# EAGLE design LED Sectional (EAGLE 9.1.3)
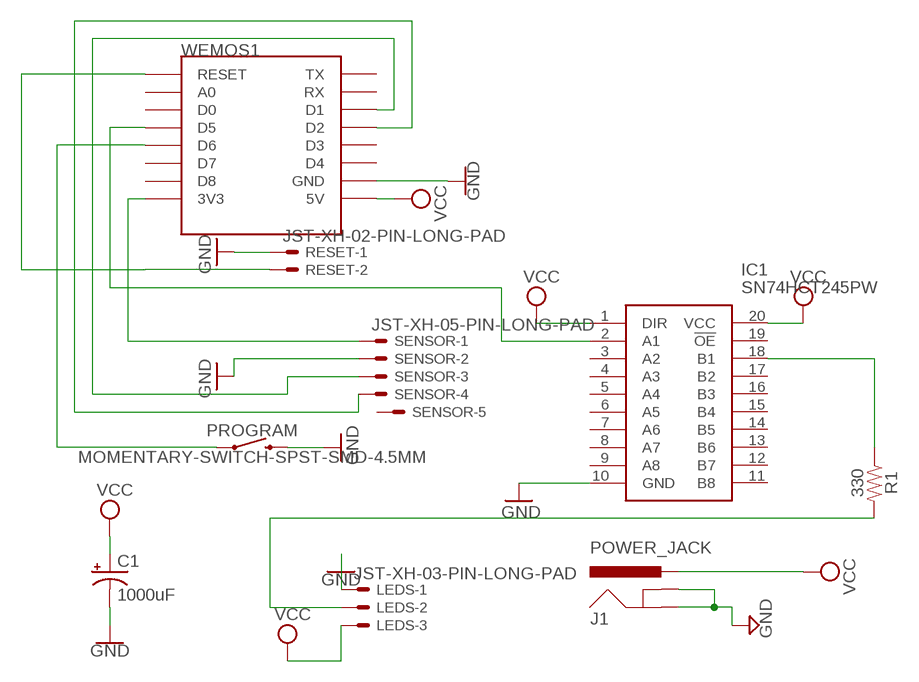
[diagram p0: schematic, sheet 1]

## Parts
C1  1000uF  CPOL-USCT7343  [CT7343]
IC1  SN74HCT245PW  [SOP65P640X120-20N]
J1  POWER_JACK  [POWER_JACK_PTH]
LEDS  JST-XH-03-PIN-LONG-PAD  [JST-XH-03-PACKAGE-LONG-PAD]
PROGRAM  MOMENTARY-SWITCH-SPST-SMD-4.5MM  [TACTILE_SWITCH_SMD_4.5MM]
R1  330  330OHM-0603-1/10W-1%  [0603]
RESET  JST-XH-02-PIN-LONG-PAD  [JST-XH-02-PACKAGE-LONG-PAD]
SENSOR  JST-XH-05-PIN-LONG-PAD  [JST-XH-05-PACKAGE-LONG-PAD]
WEMOS1  WEMOS-D1-MINI  [WEMOS-D1-MINI]

## Nets
GND: C1.- IC1.10(GND) J1.GND J1.GNDBREAK LEDS.1 PROGRAM.1 PROGRAM.4 RESET.1 SENSOR.2 WEMOS1.GND
N$1: SENSOR.1 WEMOS1.3V3
N$2: LEDS.2 R1.2
N$3: IC1.2(A1) WEMOS1.D5
N$4: IC1.18(B1) R1.1
N$5: SENSOR.3 WEMOS1.D1
N$6: SENSOR.4 WEMOS1.D2
N$7: PROGRAM.2 PROGRAM.3 WEMOS1.D6
N$8: RESET.2 WEMOS1.RESET
VCC: C1.+ IC1.1(DIR) IC1.20(VCC) J1.PWR LEDS.3 WEMOS1.5V
Unconnected: IC1.3(A2) IC1.4(A3) IC1.5(A4) IC1.6(A5) IC1.7(A6) IC1.8(A7) IC1.9(A8) IC1.11(B8) IC1.12(B7) IC1.13(B6) IC1.14(B5) IC1.15(B4) IC1.16(B3) IC1.17(B2) IC1.19(!OE) SENSOR.5 WEMOS1.A0 WEMOS1.D0 WEMOS1.D3 WEMOS1.D4 WEMOS1.D7 WEMOS1.D8 WEMOS1.RX WEMOS1.TX

## Library data of the parts
C1 = adafruit:CPOL-US: POLARIZED CAPACITOR, American symbol
IC1 = SN74HCT245PW:SN74HCT245PW: Texas Instruments SN74HCT245PW, Bus Transceiver, 8-Bit Non-Inverting CMOS, 5V, 20-Pin TSSOP Source: Datasheet <http://www.ti.com/lit/gpn/sn74hct245>; DESCRIPTION: Texas Instruments SN74HCT245PW, Bus Transceiver, 8-Bit Non-Inverting CMOS, 5V, 20-Pin TSSOP; HEIGHT: 1.2mm; MANUFACTURER_NAME: Texas Instruments; MANUFACTURER_PART_NUMBER: SN74HCT245PW; MOUSER_PART_NUMBER: 595-SN74HCT245PW; MOUSER_PRICE-STOCK: https://www.mouser.com/Search/Refine.aspx?Keyword=595-SN74HCT245PW; RS_PART_NUMBER: 6632287; RS_PRICE-STOCK: https://uk.rs-online.com/web/p/products/6632287
J1 = SparkFun-Connectors:POWER_JACK: Power Jack Connector This is the standard 5.5mm barrel jack for power. The PTH is the most common, proven, reliable, footprint. The Slot footprint only works if the mill layer is transmitted to the PCB fab house so be warned. Here are the connectors we sell at SparkFun: DC Barrel Power Jack/Connector <https://www.sparkfun.com/products/119> (PRT-00119) DC Barrel Power Jack/Connector (SMD) <https://www.sparkfun.com/products/12748> (PRT-12748) DC Barrel Jack Adapter - Breadboard Compatible <https://www.sparkfun.com/products/10811> (PRT-10811) It is used on this SparkFun product (and many, many others): SparkFun RedBoard - Programmed with Arduino <https://www.sparkfun.com/products/12757> (DEV-12757) Also, if you need a mating power supply or connector, please check these out: Wall Adapter Power Supply - 9VDC 650mA <https://www.sparkfun.com/products/298> (TOL-00298) DC Barrel Jack Adapter - Male <https://www.sparkfun.com/products/10287> (PRT-10287); PROD_ID: CONN-08197
LEDS = Rembrandt Electronics - JST XH Connectors v1-0:JST-XH-03-PIN: JST XH Connector 2 Pin Wire to board connector. Pitch: 2,54 mm, (0.100") Number of pins: 3 Created by Rembrandt Electronics www.rembrandtelectronics.com
PROGRAM = SparkFun-Switches:MOMENTARY-SWITCH-SPST: Momentary Switch (Pushbutton) - SPST Normally-open (NO) SPST momentary switches (buttons, pushbuttons). Variants PTH-12MM - 12mm square, through-hole Momentary Pushbutton Switch - 12mm Square <https://www.sparkfun.com/products/9190> (COM-09190) PTH-6.0MM, PTH-6.0MM-KIT - 6.0mm square, through-hole Mini Pushbutton Switch <https://www.sparkfun.com/products/97> (COM-00097) KIT package intended for soldering kit's - only one side of pads' copper is exposed. PTH-RIGHT-ANGLE-KIT - Right-angle, through-hole Right Angle Tactile Button <https://www.sparkfun.com/products/10791> - Used on SparkFun BigTime Watch Kit <https://www.sparkfun.com/products/11734> SMD-12MM - 12mm square, surface-mount Tactile Button - SMD (12mm) <https://www.sparkfun.com/products/12993> (COM-12993) Used on SparkFun PicoBoard <https://www.sparkfun.com/products/11888> SMD-4.5MM - 4.5mm Square Trackball Switch Used on SparkFun Blackberry Trackballer Breakout <https://www.sparkfun.com/products/13169> SMD-4.6MMX2.8MM - 4.60mm x 2.80mm, surface mount Used on SparkFun SAMD21 Mini Breakout <https://www.sparkfun.com/products/13664> SMD-5.2MM, SMD-5.2-REDUNDANT - 5.2mm square, surface-mount Mini Pushbutton Switch - SMD <https://www.sparkfun.com/products/8720> (COM-08720) Used on Arduino Pro Mini <https://www.sparkfun.com/products/11114> REDUNDANT package connects both switch circuits together SMD-6.0X3.5MM - 6.0 x 3.5mm, surface mount Momentary Reset Switch SMD <https://www.sparkfun.com/products/8229> (COM-08229) SMD-6.2MM-TALL - 6.2mm square, surface mount Tactile Button - SMD (6mm) <https://www.sparkfun.com/products/12992> Used on SparkFun Digital Sandbox <https://www.sparkfun.com/products/12651> SMD-RIGHT-ANGLE - Right-angle, surface mount Used on SparkFun Block for Intel® Edison - Arduino <https://www.sparkfun.com/products/13036>; PROD_ID: SWCH-09213
R1 = SparkFun-Resistors:330OHM: 330Ω resistor A resistor is a passive two-terminal electrical component that implements electrical resistance as a circuit element. Resistors act to reduce current flow, and, at the same time, act to lower voltage levels within circuits. - Wikipedia; PROD_ID: RES-00818
RESET = Rembrandt Electronics - JST XH Connectors v1-0:JST-XH-02-PIN: JST XH Connector 2 Pin Wire to board connector. Pitch: 2,54 mm, (0.100") Number of pins: 2 Created by Rembrandt Electronics www.rembrandtelectronics.com
SENSOR = Rembrandt Electronics - JST XH Connectors v1-0:JST-XH-05-PIN: JST XH Connector 2 Pin Wire to board connector. Pitch: 2,54 mm, (0.100") Number of pins: 5 Created by Rembrandt Electronics www.rembrandtelectronics.com
WEMOS1 = esp8266modules:WEMOS-D1-MINI: WeMos.cc D1 mini ESP8266 module

## Board
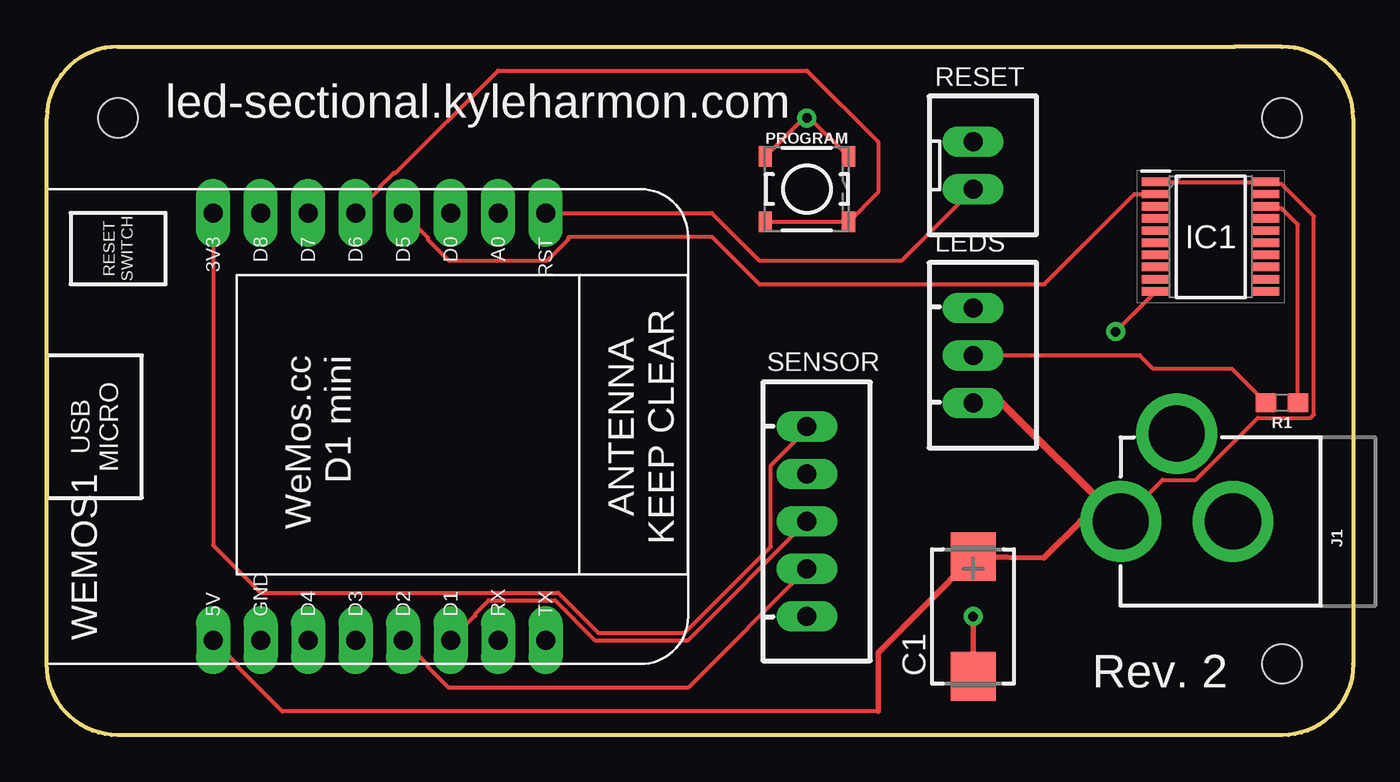
[diagram p1: board, top side]
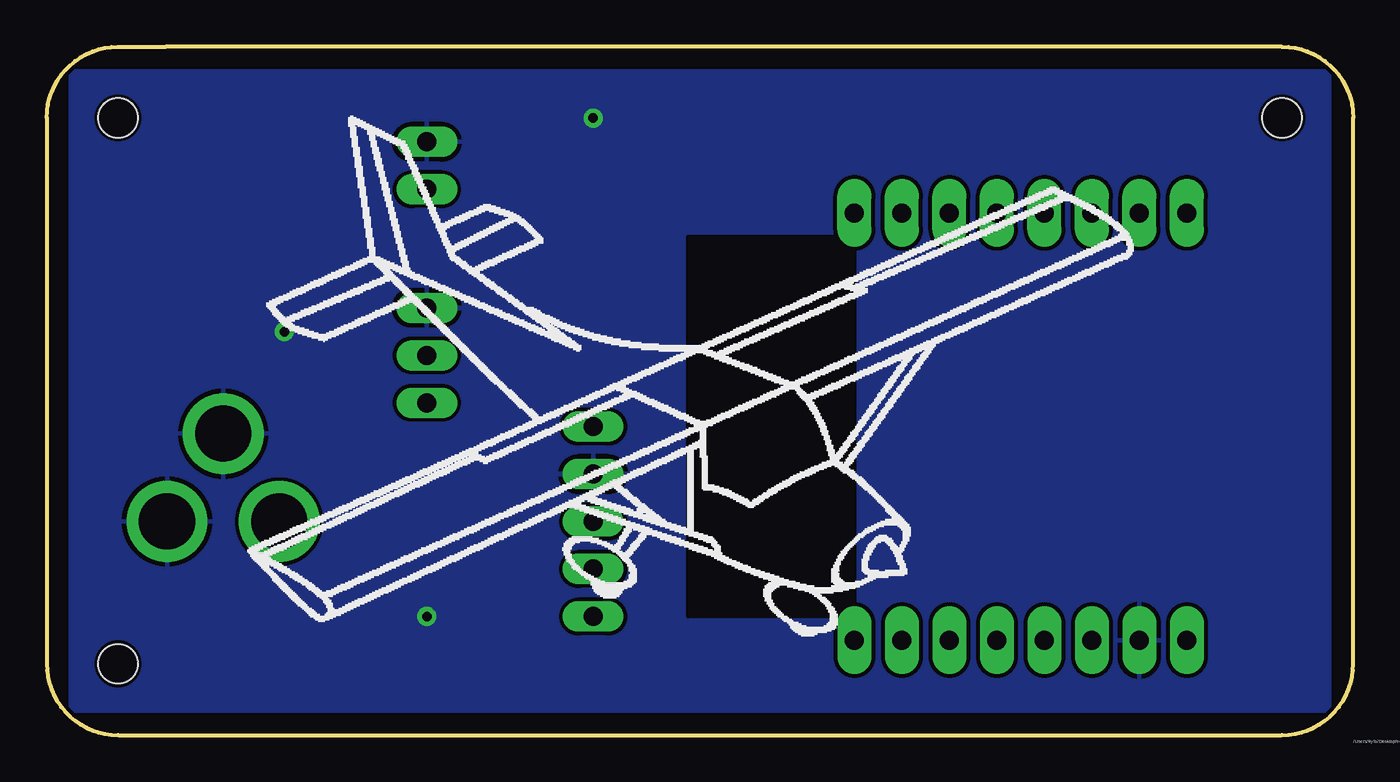
[diagram p2: board, bottom side, seen from below]

Size 69.85 x 36.83 mm. Coordinates in mm from the lower left corner, seen from the top.
Outline: 0,3.81 0,33.02 arc-90 3.81,36.83 63.5,36.83 66.04,36.83 arc-90 69.85,33.02 69.85,3.81 arc-90 66.04,0 3.81,0 arc-90 0,3.81
Copper layers (1*16): Top 0.035mm / dielectric 1.5mm / Bottom 0.035mm
Design rules "SparkFun": minimum track width 8mil, minimum drill 20mil, track to track 8mil, track to pad 8mil, pad to pad 8mil, via to via 8mil, smd to smd 8mil, copper to edge 8mil, drill to drill 8mil, minimum pad ring 12mil, minimum via ring 10mil, stop-mask expansion 4mil, vias tented up to drill 20mil, thermal gap 10mil
Holes 2.1 mm at 66.04,3.81 66.04,33.02 3.81,33.02

### Footprints (pad centres in the part's own frame; a part is rotated, then mirrored left to right if it is on the bottom)
CT7343 = smd 2.6 x 2.4: + 3.2,0; - -3.2,0
SOP65P640X120-20N = smd 1.475 x 0.45: 1 -2.938,2.925; 2 -2.938,2.275; 3 -2.938,1.625; 4 -2.938,0.975; 5 -2.938,0.325; 6 -2.938,-0.325; 7 -2.938,-0.975; 8 -2.938,-1.625; 9 -2.938,-2.275; 10 -2.938,-2.925; 11 2.938,-2.925; 12 2.938,-2.275; 13 2.938,-1.625; 14 2.938,-0.975; 15 2.938,-0.325; 16 2.938,0.325; 17 2.938,0.975; 18 2.938,1.625; 19 2.938,2.275; 20 2.938,2.925
POWER_JACK_PTH = drill 2.997 pad 4.318: GND 0,7.7; GNDBREAK 4.7,10.7; PWR 0,13.7
JST-XH-03-PACKAGE-LONG-PAD = drill 1.016 long: 1 -2.54,0; 2 0,0; 3 2.54,0
TACTILE_SWITCH_SMD_4.5MM = smd 0.7 x 1.1: 1 2.225,1.75; 2 2.225,-1.75; 3 -2.225,-1.75; 4 -2.225,1.75
0603 = smd 1.1 x 1: 1 -0.85,0; 2 0.85,0
JST-XH-02-PACKAGE-LONG-PAD = drill 1.016 long: 1 -1.27,0; 2 1.27,0
JST-XH-05-PACKAGE-LONG-PAD = drill 1.016 long: 1 -5.08,0; 2 -2.54,0; 3 0,0; 4 2.54,0; 5 5.08,0
WEMOS-D1-MINI = drill 1.016 pad 1.829 long: 3V3 -10.16,-10.16; 5V 12.7,-10.16; A0 -10.16,5.08; D0 -10.16,2.54; D1 12.7,2.54; D2 12.7,0; D3 12.7,-2.54; D4 12.7,-5.08; D5 -10.16,0; D6 -10.16,-2.54; D7 -10.16,-5.08; D8 -10.16,-7.62; GND 12.7,-7.62; RESET -10.16,7.62; RX 12.7,5.08; TX 12.7,7.62

### Placement (x,y rotation side)
C1  49.53,6.35 90 top
IC1  62.23,26.67 0 top
J1  71.12,11.43 90 top
LEDS  49.53,20.32 270 top
PROGRAM  40.64,29.21 0 top
R1  66.04,17.78 180 top
RESET  49.53,30.48 270 top
SENSOR  40.64,11.43 270 top
WEMOS1  19.05,17.78 270 top

### Tracks (layer width: path | path; a pad name or v marks a point on that pad's centre or on a via)
GND  (via drill 0.51)
  Top 0.203: PROGRAM.4 40.48,33.02 v40.64,33.02 40.8,33.02 PROGRAM.1 | IC1.10 57.15,21.6 v57.15,21.59
  Top 0.305: C1.- v49.53,6.35
  pour Bottom: 1.27,35.56 1.27,1.27 68.58,1.27 68.58,35.56
  cutout Bottom: 26.67,26.67 26.67,6.35 35.56,6.35 35.56,26.67
N$1
  Top 0.203: WEMOS1.3V3 8.89,10.16 11.43,7.62 27.34,7.62 29.48,5.49 34.12,5.49 38.71,10.07 38.71,14.43 40.64,16.36 SENSOR.1
N$2
  Top 0.203: R1.2 63.38,19.59 59.16,19.59 58.44,20.32 LEDS.2
N$3
  Top 0.203: WEMOS1.D5 20.37,26.62 20.37,26.52 21.49,25.4 26.77,25.4 27.89,26.52 27.89,26.62 27.94,26.67 35.56,26.67 38.1,24.13 53.34,24.13 58.16,28.95 IC1.2
N$4
  Top 0.203: IC1.18 65.29,28.18 66.03,28.18 66.89,27.32 R1.1
N$5
  Top 0.203: SENSOR.3 34.29,5.08 29.31,5.08 27.18,7.21 23.62,7.21 22.91,6.5 22.91,6.4 WEMOS1.D1
N$6
  Top 0.203: SENSOR.4 34.29,2.54 21.49,2.54 20.37,3.66 20.37,3.76 WEMOS1.D2
N$7
  Top 0.203: WEMOS1.D6 17.83,29.26 17.83,29.36 18.55,30.07 18.64,30.07 24.13,35.56 40.64,35.56 44.45,31.75 44.45,29.05 PROGRAM.2 PROGRAM.3
N$8
  Top 0.203: WEMOS1.RESET 35.56,27.94 38.1,25.4 45.72,25.4 RESET.2
VCC
  Top 0.203: J1.PWR 59.66,13.67 61.44,13.67 64.75,16.98 67.57,16.98 67.75,17.15 67.75,27.76 66.03,29.48 65.29,29.48 IC1.20 IC1.1 | WEMOS1.5V 10.21,3.76 10.21,3.66 12.6,1.27 44.45,1.27
  Top 0.305: 55.27,11.43 53.31,9.47 C1.+ 44.45,4.39 44.45,1.27
  Top 0.406: 55.27,11.43 J1.PWR 51.07,17.78 LEDS.3

### Text on the board
tPlace: led-sectional.kyleharmon.com | Rev. 2
bPlace: /Users/kyle/Desktop/engine-clipart-plane-engine-2.bmp